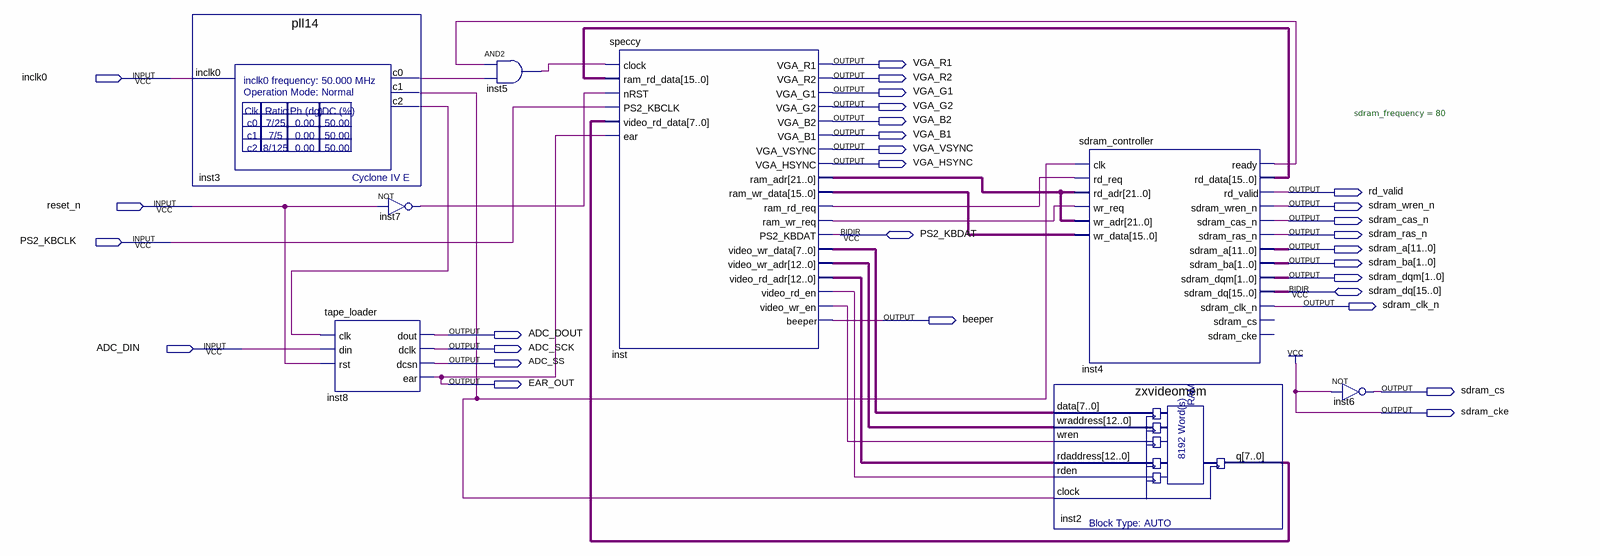
[diagram p0: schematic sheet]
// Quartus schematic spec.bdf as structural Verilog: 8 symbols, 29 pins
module spec (
  input  inclk0,
  input  reset_n,
  input  PS2_KBCLK,
  input  ADC_DIN,
  inout  PS2_KBDAT,
  inout  [15:0] sdram_dq,
  output VGA_R1,
  output VGA_R2,
  output VGA_G1,
  output VGA_G2,
  output VGA_B2,
  output VGA_B1,
  output VGA_VSYNC,
  output VGA_HSYNC,
  output rd_valid,
  output sdram_wren_n,
  output sdram_cas_n,
  output sdram_ras_n,
  output [11:0] sdram_a,
  output [1:0] sdram_ba,
  output [1:0] sdram_dqm,
  output sdram_clk_n,
  output beeper,
  output ADC_DOUT,
  output ADC_SCK,
  output ADC_SS,
  output EAR_OUT,
  output sdram_cs,
  output sdram_cke
);

  wire inst3_c0, inst3_c1, inst3_c2, inst4_ready, inst5_out, inst7_out, inst_ram_rd_req, inst_ram_wr_req,
       inst_video_rd_en, inst_video_wr_en;
  wire [7:0] inst2_q, inst_video_wr_data;
  wire [12:0] inst_video_rd_adr, inst_video_wr_adr;
  wire [15:0] inst4_rd_data, inst_ram_wr_data;
  wire [21:0] inst_ram_adr;

  pll14 inst3 (.inclk0(inclk0), .c0(inst3_c0), .c1(inst3_c1), .c2(inst3_c2));
  tape_loader inst8 (
    .clk(inst3_c2), .din(ADC_DIN), .rst(reset_n), .dout(ADC_DOUT), .dclk(ADC_SCK), .dcsn(ADC_SS),
    .ear(EAR_OUT));
  not inst7 (inst7_out, reset_n);
  and inst5 (inst5_out, inst4_ready, inst3_c0);
  speccy inst (
    .clock(inst5_out), .ram_rd_data(inst4_rd_data), .nRST(inst7_out), .PS2_KBCLK(PS2_KBCLK),
    .video_rd_data(inst2_q), .ear(EAR_OUT), .VGA_R1(VGA_R1), .VGA_R2(VGA_R2), .VGA_G1(VGA_G1),
    .VGA_G2(VGA_G2), .VGA_B2(VGA_B2), .VGA_B1(VGA_B1), .VGA_VSYNC(VGA_VSYNC), .VGA_HSYNC(VGA_HSYNC),
    .ram_adr(inst_ram_adr), .ram_wr_data(inst_ram_wr_data), .ram_rd_req(inst_ram_rd_req),
    .ram_wr_req(inst_ram_wr_req), .video_wr_data(inst_video_wr_data), .video_wr_adr(inst_video_wr_adr),
    .video_rd_adr(inst_video_rd_adr), .video_rd_en(inst_video_rd_en), .video_wr_en(inst_video_wr_en),
    .beeper(beeper), .PS2_KBDAT(PS2_KBDAT));
  sdram_controller #(.sdram_frequency(80)) inst4 (
    .clk(inst3_c1), .rd_req(inst_ram_rd_req), .rd_adr(inst_ram_adr), .wr_req(inst_ram_wr_req),
    .wr_adr(inst_ram_adr), .wr_data(inst_ram_wr_data), .ready(inst4_ready), .rd_data(inst4_rd_data),
    .rd_valid(rd_valid), .sdram_wren_n(sdram_wren_n), .sdram_cas_n(sdram_cas_n), .sdram_ras_n(sdram_ras_n),
    .sdram_a(sdram_a), .sdram_ba(sdram_ba), .sdram_dqm(sdram_dqm), .sdram_clk_n(sdram_clk_n),
    .sdram_dq(sdram_dq));  // open: sdram_cs, sdram_cke
  zxvideomem inst2 (
    .data(inst_video_wr_data), .wraddress(inst_video_wr_adr), .wren(inst_video_wr_en),
    .rdaddress(inst_video_rd_adr), .rden(inst_video_rd_en), .clock(inst3_c1), .q(inst2_q));
  not inst6 (sdram_cs, 1'b1);

  assign sdram_cke = 1'b1;
endmodule
